# Altium schematic sheet lipo_alarm.SchDoc
size A4
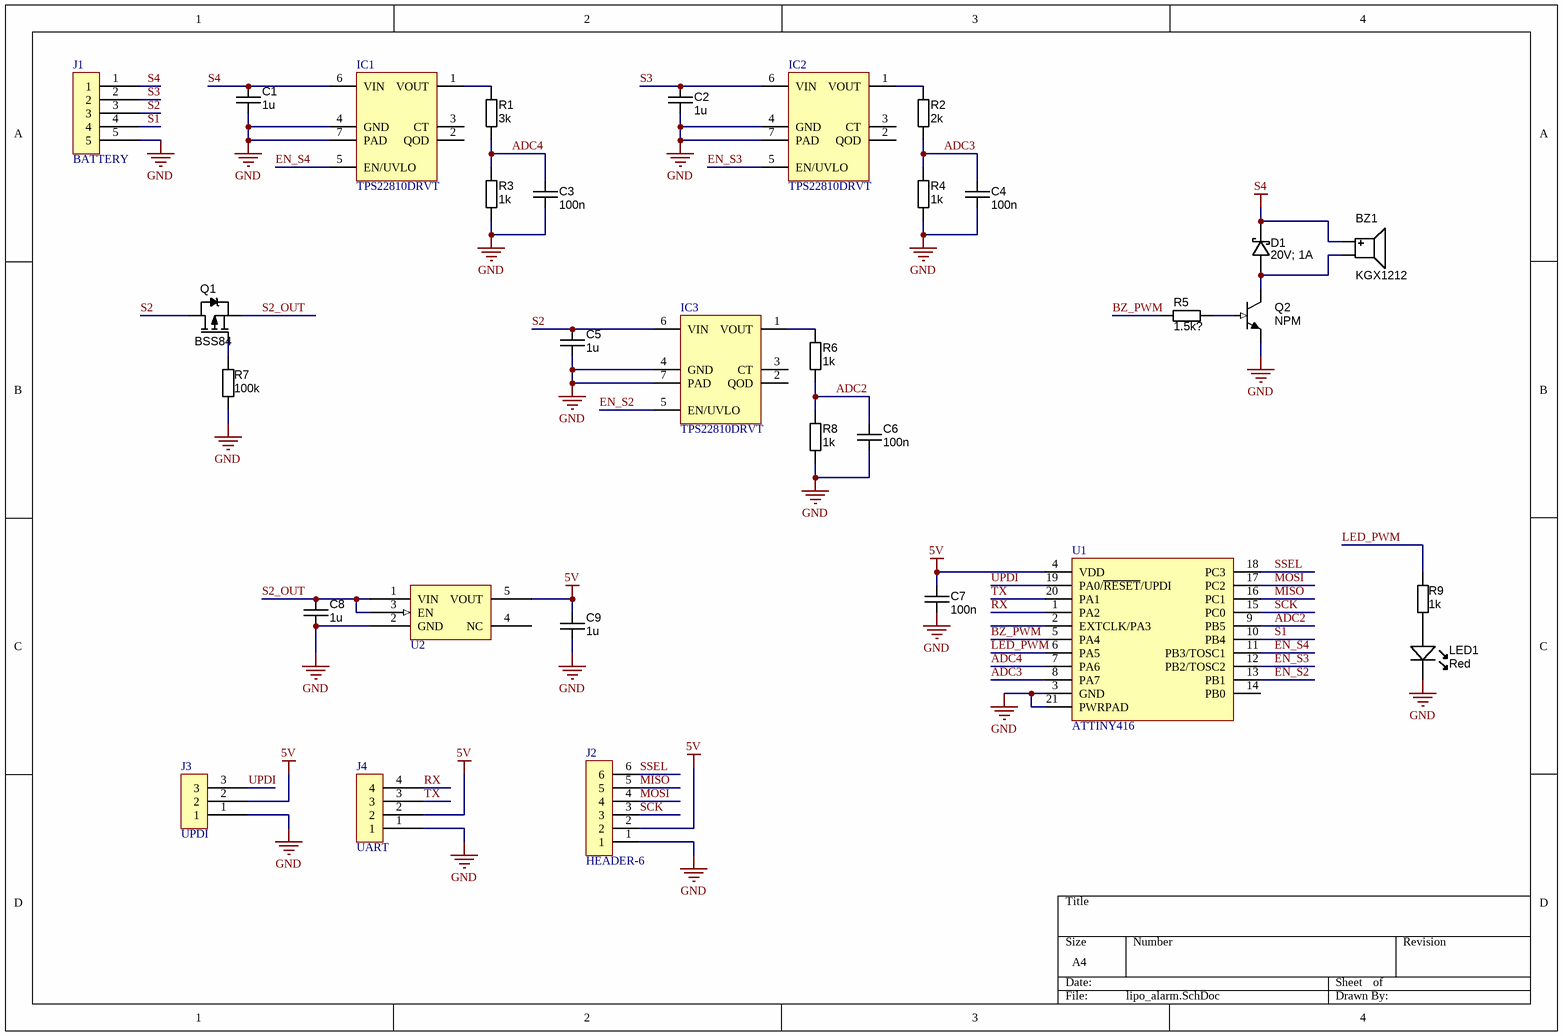
[diagram p0: lipo_alarm.SchDoc]

## Parts
BZ1  KGX1212  [KXG1212]
C1  1u  [CAPC1608X90N]
C2  1u  [CAPC1608X90N]
C3  100n  [CAPC1608X90N]
C4  100n  [CAPC1608X90N]
C5  1u  [CAPC1608X90N]
C6  100n  [CAPC1608X90N]
C7  100n  [CAPC1608X90N]
C8  1u  [CAPC1608X90N]
C9  1u  [CAPC1608X90N]
D1  20V; 1A  [SOD123]
IC1  TPS22810DRVT  [WSON-6]
IC2  TPS22810DRVT  [WSON-6]
IC3  TPS22810DRVT  [WSON-6]
J1  BATTERY  [JST-XH-5-TH-PCB-CUTOUT]
J2  HEADER-6  [MICRO-MATCH-FOB-06]
J3  UPDI  [PADS-3-1020]
J4  UART  [PADS-4-1020]
LED1  Red  [LED-0805S-SIDELED-2.1X0.6X1.0]
Q1  BSS84  [SOT23-3]
Q2  NPM  [SOT23-3]
R1  3k  [RESC1608X55N]
R2  2k  [RESC1608X55N]
R3  1k  [RESC1608X55N]
R4  1k  [RESC1608X55N]
R5  1.5k?  [RESC1608X55N]
R6  1k  [RESC1608X55N]
R7  100k  [RESC1608X55N]
R8  1k  [RESC1608X55N]
R9  1k  [RESC1608X55N]
U1  ATTINY416  [QFN40P300X300X90_HS-21M]
U2  LDO-SOT23-5  [SOT23-5]  (value not drawn)

## Nets
5V: C7.1 C9.1 J2.2 J3.2 J4.2 U1.4(VDD) U2.5(VOUT)
GND: C1.2 C2.2 C3.2 C4.2 C5.2 C6.2 C7.2 C8.2 C9.2 IC1.4(GND) IC1.7(PAD) IC2.4(GND) IC2.7(PAD) IC3.4(GND) IC3.7(PAD) J1.5 J2.1 J3.1 J4.1 LED1.K Q2.2(E) R3.2 R4.2 R7.1 R8.2 U1.3(GND) U1.21(PWRPAD) U2.2(GND)
S4: BZ1.1(Positive) C1.1 D1.K IC1.6(VIN) J1.1
ADC2: C6.1 R6.2 R8.1 U1.9(PB5)
ADC3: C4.1 R2.2 R4.1 U1.8(PA7)
ADC4: C3.1 R1.2 R3.1 U1.7(PA6)
BZ_PWM: R5.1 U1.5(PA4)
EN_S2: IC3.5(EN/UVLO) U1.13(PB1)
EN_S3: IC2.5(EN/UVLO) U1.12(PB2/TOSC2)
EN_S4: IC1.5(EN/UVLO) U1.11(PB3/TOSC1)
LED_PWM: R9.1 U1.6(PA5)
MISO: J2.5 U1.16(PC1)
MOSI: J2.4 U1.17(PC2)
RX: J4.4 U1.1(PA2)
S1: J1.4 U1.10(PB4)
S2: C5.1 IC3.6(VIN) J1.3 Q1.3(D)
S2_OUT: C8.1 Q1.2(S) U2.1(VIN) U2.3(EN)
S3: C2.1 IC2.6(VIN) J1.2
SCK: J2.3 U1.15(PC0)
SSEL: J2.6 U1.18(PC3)
TX: J4.3 U1.20(PA1)
UPDI: J3.3 U1.19(PA0/~{RESET}/UPDI)
NetBZ1_2: BZ1.2(Negative) D1.A Q2.3(C)
NetIC1_1: IC1.1(VOUT) R1.1
NetIC2_1: IC2.1(VOUT) R2.1
NetIC3_1: IC3.1(VOUT) R6.1
NetLED1_A: LED1.A R9.2
NetQ1_1: Q1.1(G) R7.2
NetQ2_1: Q2.1(B) R5.2

Not connected (* = marked no-connect by the designer): IC1 2(QOD) 3(CT); IC2 2(QOD) 3(CT); IC3 2(QOD) 3(CT); U1 2(EXTCLK/PA3) 14(PB0); U2 4(NC)

## Notes on the sheet
- Size:
- Date:
- A4
- Sheet
- Drawn by:
- of
- Revision:
- SmartStuff OÜ
- Näituse 26
- 50407 Tartu
- Estonia
- File name:

## Library data of the parts
BZ1 = BUZZER
C1 C5 = CAPC_1u_0603_X7R_16V_10%: Capacitor SMD Cer 1uF 10% 16V X7R 0603; Manufacturer 1: TDK Corporation; Manufacturer Part Number 1: C1608X7R1C105K; Ratings: 16V; X7R; Material: ceramic; SCDType: spec; Value: 1µ; Package / Case: 0603 (1608 metric); Tolerance: ±10%; Supplier 1: Digi-Key; Supplier Part Number 1: 445-1604-1-ND; ComponentLink1URL: http://product.tdk.com/capacitor/mlcc/en/documents/mlcc_commercial_general_en.pdf; ComponentLink1Description: http://product.tdk.com/capacitor/mlcc/en/documents/mlcc_commercial_general_en.pdf
C2 = CAPC_100n_0603_X7R_50V_10%: Capacitor SMD Cer 1uF 10% 50V X7R 0603; Manufacturer 1: AVX Corporation; Manufacturer Part Number 1: 06035C104KAT2A; Ratings: 50V; X7R; Material: ceramic; SCDType: spec; Manufacturer 2: TDK Corporation; Manufacturer Part Number 2: C1608X7R1H104K; Package / Case: 0603 (1608 Metric); Tolerance: ±10%; Supplier 1: Digi-Key; Supplier Part Number 1: 478-5052-1-ND; ComponentLink1URL: http://www.avx.com/docs/Catalogs/cx7r.pdf; ComponentLink1Description: http://www.avx.com/docs/Catalogs/cx7r.pdf; Supplier 2: Digi-Key; Supplier Part Number 2: 445-1314-1-ND; ComponentLink2URL: http://product.tdk.com/capacitor/mlcc/en/documents/mlcc_commercial_general_en.pdf; ComponentLink2Description: http://product.tdk.com/capacitor/mlcc/en/documents/mlcc_commercial_general_en.pdf; Value: 1uF
C3 C4 C6 C7 = CAPC_100n_0603_X7R_50V_10%: Capacitor SMD Cer 100nF 10% 50V X7R 0603; Manufacturer 1: AVX Corporation; Manufacturer Part Number 1: 06035C104KAT2A; Ratings: 50V; X7R; Material: ceramic; SCDType: spec; Manufacturer 2: TDK Corporation; Manufacturer Part Number 2: C1608X7R1H104K; Package / Case: 0603 (1608 Metric); Tolerance: ±10%; Supplier 1: Digi-Key; Supplier Part Number 1: 478-5052-1-ND; ComponentLink1URL: http://www.avx.com/docs/Catalogs/cx7r.pdf; ComponentLink1Description: http://www.avx.com/docs/Catalogs/cx7r.pdf; Supplier 2: Digi-Key; Supplier Part Number 2: 445-1314-1-ND; ComponentLink2URL: http://product.tdk.com/capacitor/mlcc/en/documents/mlcc_commercial_general_en.pdf; ComponentLink2Description: http://product.tdk.com/capacitor/mlcc/en/documents/mlcc_commercial_general_en.pdf; Value: 100n
C8 C9 = CAPC_2u2_0603_10V_10%: Capacitor SMD Cer 2.2uF 10% 10V X5R 0603; Manufacturer 1: AVX Corporation; Manufacturer Part Number 1: 0603ZD225KAT2A; Ratings: 10V; X5R; Material: ceramic; SCDType: spec; Package / Case: 0603 (1608 metric); Tolerance: ±10%; Supplier 1: Digi-Key; Supplier Part Number 1: 478-6212-1-ND; ComponentLink1URL: http://www.avx.com/docs/Catalogs/cx5r.pdf; ComponentLink1Description: http://www.avx.com/docs/Catalogs/cx5r.pdf; Value: 1u
D1 = DIODE_SCHOTTKY_40V_1A: Diode Schottky SMD 20V 1A SOD123; Manufacturer 1: Diodes Inc; Manufacturer Part Number 1: 1N5819HW-7-F; Ratings: 40V; 1A; Material: Si; SCDType: spec; Package / Case: SOD123; Diode Type: Schottky; Mounting Type: Surface Mount; Supplier 1: Digi-Key; Supplier Part Number 1: 1N5819HW-FDICT-ND
IC1-IC3 = TPS22810DRVT: Power Load Switch, 18Vin, 3A, 0.079R, WSON-6, High Side,  TPS22810, TEXAS INSTRUMENTS; Number of Channels: 1; Input Voltage Range: 2.7V .. 18V; Supplier 1: Farnell; Manufacturer: Texas Instruments; Manufacturer Part Number: TPS22810DRVT; Operating Temperature Range: -40°C .. 105°C; ComponentLink1URL: http://www.ti.com/lit/ds/symlink/tps22810.pdf; ComponentLink1Description: Datasheet; Supplier 2: Mouser; On-Resistance: 0.079R; Package: WSON-6; Supplier Part Number 1: 2769481; Supplier Part Number 2: 595-TPS22810DRVT
J1 = HEADER-5
J3 = HEADER-3
J4 = HEADER-4
LED1 = LED_SMD_RED_0805RA_250mcd: LED SMD SIDELED Red 630nm 250mcd 0805; Manufacturer 1: Kingbright Corp; Manufacturer Part Number 1: APA2106SURCK; Material: Al-InGaN; Ratings: 250 mcd; 630 nm; SCDType: spec; Package / Case: 2.1x0.6x1.0mm SIDELED; Value: Red; Supplier 1: Digi-Key; Supplier Part Number 1: 754-1060-1-ND; Color: Red
Q1 = MOSFET_BSS84: MOSFET SMD P-CH 50V 130mA SOT23-3; Manufacturer 1: Fairchild Semiconductor; Ratings: 50V; 130mA; Material: Metal Oxide; FET Type: MOSFET P-Channel, Metal Oxide; FET Feature: Logic Level Gate; Rds On (Max) @ Id, Vgs: 10 Ohm @ 100mA, 5V; Vgs(th) (Max) @ Id: 2V @ 1mA; Gate Charge (Qg) @ Vgs: 1.3nC @ 5V; Input Capacitance (Ciss) @ Vds: 73pF @ 25V; Power - Max: 360mW; SCDType: undef; Package / Case: SOT23-3; Supplier 1: Digi-Key; Supplier Part Number 1: BSS84CT-ND; Manufacturer Part Number 1: BSS84; Drain to Source Voltage (Vdss): 50V; Current - Continuous Drain (Id) @ 25° C: 130mA; Supplier Device Package: SOT-23; ComponentLink1URL: http://www.fairchildsemi.com/ds/BS/BSS84.pdf; ComponentLink1Description: http://www.fairchildsemi.com/ds/BS/BSS84.pdf
Q2 = NPN_FMMT617TA: Transistor SMD NPN 15V 3A SOT-23; Manufacturer 1: Diodes/Zetex; Ratings: 15V; 3A; 625mW; SCDType: spec; Supplier 1: Digi-Key; Supplier Part Number 1: FMMT617CT-ND; Package / Case: SOT-23; Manufacturer Part Number 1: FMMT617TA
R1-R9 = RES_1K_0603_5%: Resistor SMD chip 1k Ohm 0.1W 5% 0603; Manufacturer 1: Yageo; Manufacturer Part Number 1: RC0603JR-071KL; Ratings: 1/10 W; SCDType: spec; Value: 20M; Package / Case: 0603 (1608 metric); Tolerance: ±5%; Material: Thick Film; Supplier 1: Digi-Key; Supplier Part Number 1: 311-1.0KGRCT-ND; Supplier 2: Digi-Key; Supplier Part Number 2: 541-1.0KGCT-ND; Manufacturer 2: Vishay Dale; Manufacturer Part Number 2: CRCW06031K00JNEA; ComponentLink2URL: http://www.vishay.com/doc?20008; ComponentLink2Description: http://www.vishay.com/doc?20008; ComponentLink1URL: http://www.yageo.com/documents/recent/PYu-RC0603_51_RoHS_L_4.pdf; ComponentLink1Description: http://www.yageo.com/documents/recent/PYu-RC0603_51_RoHS_L_4.pdf